# EAGLE design Stromlaufplan_Wetterstation_Team1_EAGLE7 (EAGLE 7.7.0)
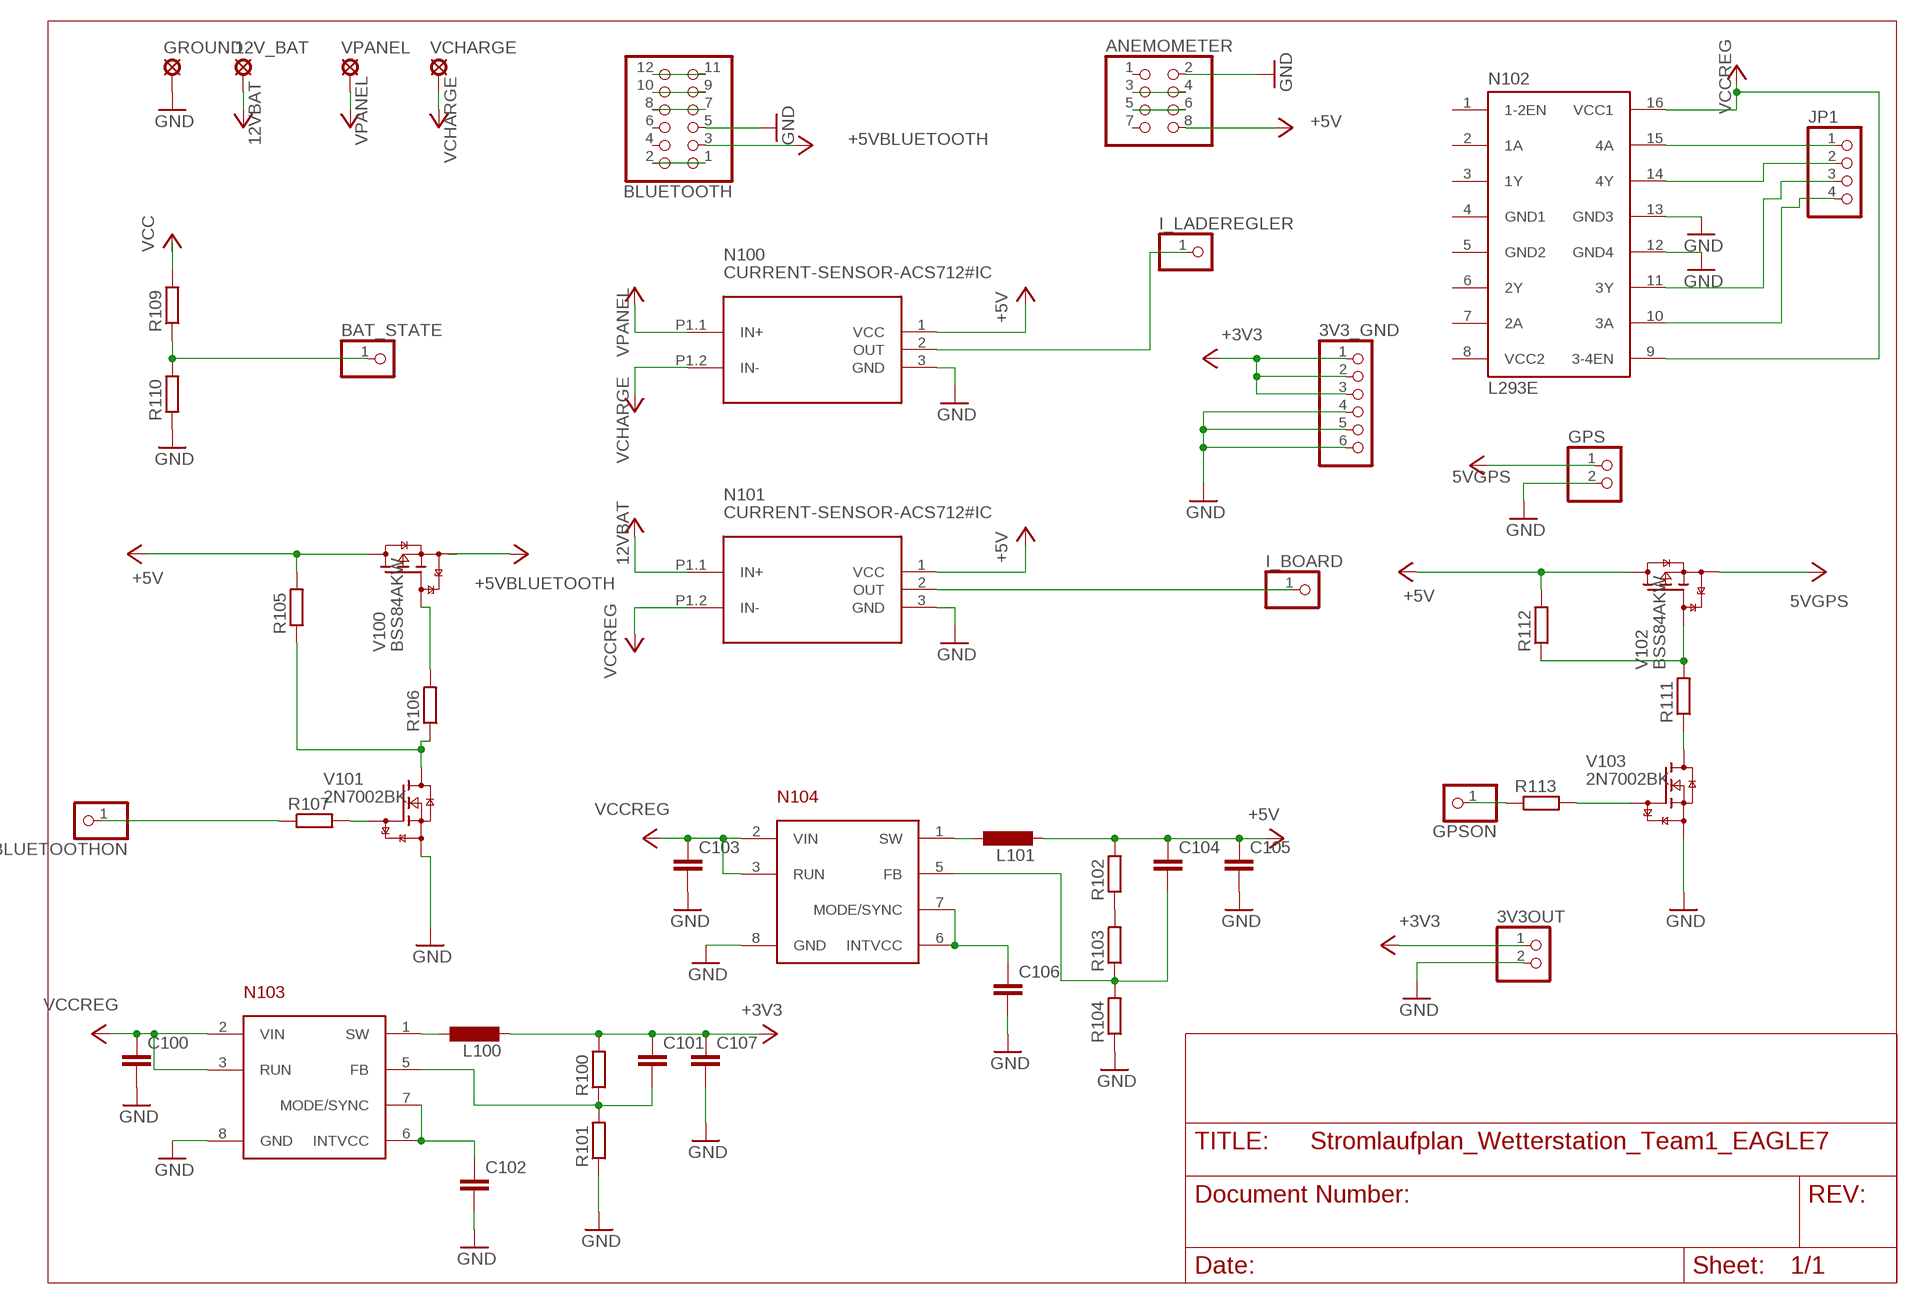
[diagram p0: schematic, sheet 1]

## Parts
3V3_GND  PINHD-1X6  [1X06]
3V3OUT  PINHD-1X2  [1X02]
12V_BAT  SE14  [SE14]
ANEMOMETER  PINHD-2X4  [2X04]
BAT_STATE  PINHD-1X1  [1X01]
BLUETOOTH  PINHD-2X6  [2X06]
BLUETOOTHON  PINHD-1X1  [1X01]
C100  C-EUC0603  [C0603]
C101  C-EUC0603  [C0603]
C102  C-EUC0603  [C0603]
C103  C-EUC0603  [C0603]
C104  C-EUC0603  [C0603]
C105  C-EUC0603  [C0603]
C106  C-EUC0603  [C0603]
C107  C-EUC0603  [C0603]
GPS  PINHD-1X2  [1X02]
GPSON  PINHD-1X1  [1X01]
GROUND  SE14  [SE14]
I_BOARD  PINHD-1X1  [1X01]
I_LADEREGLER  PINHD-1X1  [1X01]
JP1  PINHD-1X4  [1X04]
L100  L-EU0207/5V  [0207/5V]
L101  L-EU0207/5V  [0207/5V]
N100  CURRENT-SENSOR-ACS712#IC  [CURRENT-SENSOR-ACS712#IC]
N101  CURRENT-SENSOR-ACS712#IC  [CURRENT-SENSOR-ACS712#IC]
N102  L293E  [DIL16]
N103  LTC3621  [LTC3621FP]
N104  LTC3621  [LTC3621FP]
R100  R-EU_R0603  [R0603]
R101  R-EU_R0603  [R0603]
R102  R-EU_R0603  [R0603]
R103  R-EU_R0603  [R0603]
R104  R-EU_R0603  [R0603]
R105  100k  R-EU_R0603  [R0603]
R106  1k  R-EU_R0603  [R0603]
R107  1k  R-EU_R0603  [R0603]
R109  270k  R-EU_R0603  [R0603]
R110  100k  R-EU_R0603  [R0603]
R111  R-EU_R0603  [R0603]
R112  R-EU_R0603  [R0603]
R113  R-EU_R0603  [R0603]
V100  BSS84AKW  [SOT323]
V101  2N7002BK  [SOT23]
V102  BSS84AKW  [SOT323]
V103  2N7002BK  [SOT23]
VCHARGE  SE14  [SE14]
VPANEL  SE14  [SE14]

## Nets
5VGPS: GPS.1 V102.2(S) ; supply symbol labelled VCC
12VBAT: 12V_BAT.MP N101.P1.1(IN+) R109.2 ; supply symbol labelled VCC
+3V3: 3V3_GND.1 3V3_GND.2 3V3_GND.3 3V3OUT.1 C101.1 C107.1 L100.2 R100.2 ; supply symbol labelled VCC
+5V: ANEMOMETER.8 C104.1 C105.1 L101.2 N100.1(VCC) N101.1(VCC) R102.2 R105.2 R112.2 V100.3(D) V102.3(D) ; supply symbol labelled VCC
+5VBLUETOOTH: BLUETOOTH.3 V100.2(S) ; supply symbol labelled +5V
BLUETOOTH_ON: BLUETOOTHON.1 R107.1
GND: 3V3_GND.4 3V3_GND.5 3V3_GND.6 3V3OUT.2 ANEMOMETER.2 BLUETOOTH.5 C100.2 C102.2 C103.2 C105.2 C106.2 C107.2 GPS.2 GROUND.MP N100.3(GND) N101.3(GND) N102.12(GND4) N102.13(GND3) N103.8(GND) N104.8(GND) R101.1 R104.1 R110.1 V101.2(S) V103.2(S)
N$1: R106.2 V100.1(G)
N$2: C102.1 N103.6(INTVCC) N103.7(MODE/SYNC)
N$3: R107.2 V101.1(G)
N$4: R105.1 R106.1 V101.3(D)
N$5: L100.1 N103.1(SW)
N$6: JP1.1 N102.15(4A)
N$7: JP1.2 N102.14(4Y)
N$8: JP1.3 N102.11(3Y)
N$9: JP1.4 N102.10(3A)
N$10: L101.1 N104.1(SW)
N$11: C101.2 N103.5(FB) R100.1 R101.2
N$12: C106.1 N104.6(INTVCC) N104.7(MODE/SYNC)
N$13: R102.1 R103.2
N$14: C104.2 N104.5(FB) R103.1 R104.2
N$15: I_LADEREGLER.1 N100.2(OUT)
N$16: I_BOARD.1 N101.2(OUT)
N$17: BAT_STATE.1 R109.1 R110.2
N$18: R113.2 V103.1(G)
N$19: R111.1 V103.3(D)
N$20: R111.2 R112.1 V102.1(G)
N$21: GPSON.1 R113.1
N$22: BLUETOOTH.1 BLUETOOTH.2
N$23: BLUETOOTH.11 BLUETOOTH.12
N$24: BLUETOOTH.9 BLUETOOTH.10
N$25: BLUETOOTH.7 BLUETOOTH.8
N$26: ANEMOMETER.3 ANEMOMETER.4
N$27: ANEMOMETER.5 ANEMOMETER.6
VCCREG: C100.1 C103.1 N101.P1.2(IN-) N102.9(3-4EN) N102.16(VCC1) N103.2(VIN) N103.3(RUN) N104.2(VIN) N104.3(RUN) ; supply symbol labelled VCC
VCHARGE: N100.P1.2(IN-) VCHARGE.MP ; supply symbol labelled VCC
VPANEL: N100.P1.1(IN+) VPANEL.MP ; supply symbol labelled VCC
Unconnected: ANEMOMETER.1 ANEMOMETER.7 BLUETOOTH.4 BLUETOOTH.6 N102.1(1-2EN) N102.2(1A) N102.3(1Y) N102.6(2Y) N102.7(2A)

## Power pins joined to a net without a drawn wire
GND1: N102.4(GND1)
GND2: N102.5(GND2)
VCC2: N102.8(VCC2)

## Library data of the parts
3V3_GND = pinhead:PINHD-1X6: PIN HEADER
3V3OUT GPS = pinhead:PINHD-1X2: PIN HEADER
12V_BAT GROUND VCHARGE VPANEL = solpad:SE14: SOLDER PAD E1553, drill 1,4mm, distributor Buerklin, 07F820
ANEMOMETER = pinhead:PINHD-2X4: PIN HEADER
BAT_STATE BLUETOOTHON GPSON I_BOARD I_LADEREGLER = pinhead:PINHD-1X1: PIN HEADER
BLUETOOTH = pinhead:PINHD-2X6: PIN HEADER
C100-C107 = rcl:C-EU: CAPACITOR, European symbol; SPICEPREFIX: C
JP1 = pinhead:PINHD-1X4: PIN HEADER
L100 L101 = rcl:L-EU: INDUCTOR, European symbol; SPICEPREFIX: L
N100 N101 = diy-modules:CURRENT-SENSOR-ACS712#IC: Isolated Bipolar Current Sensors based on ACS712 chip Symbol with input pins More details available here: http://embedded-lab.com/blog/a-brief-overview-of-allegro-acs712-current-sensor-part-1/ Click here to find device on ebay.com <http://www.ebay.com/sch/acs712+module> Note: There are many available versions with different pinout. Please check before use
N102 = texas:L293E: TI DEVICE; MF: Arrow Electronics; MPN: L293E; OC_FARNELL: 1467711; OC_NEWARK: 89K0732
N103 N104 = SOP65P490X110-8N:LTC3621
R100-R107 R109-R113 = rcl:R-EU_: RESISTOR, European symbol; SPICEPREFIX: R
V100 V102 = nxp_60:BSS84A: 50 V, 150 mA P-channel Trench MOSFET P-channel enhancement mode Field-Effect Transistor (FET) in a small Surface-Mounted Device (SMD) plastic package using Trench MOSFET technology. AAL Eindhoven MK
V101 V103 = nxp_60:2N7002B: 60 V, single N-channel Trench MOSFET N-channel enhancement mode Field-Effect Transistor (FET) in a leadless ultra small DFN1006B-3 (SOT883B) Surface-Mounted Device (SMD) plastic package using Trench MOSFET technology. AAL Eindhoven MK

## Board
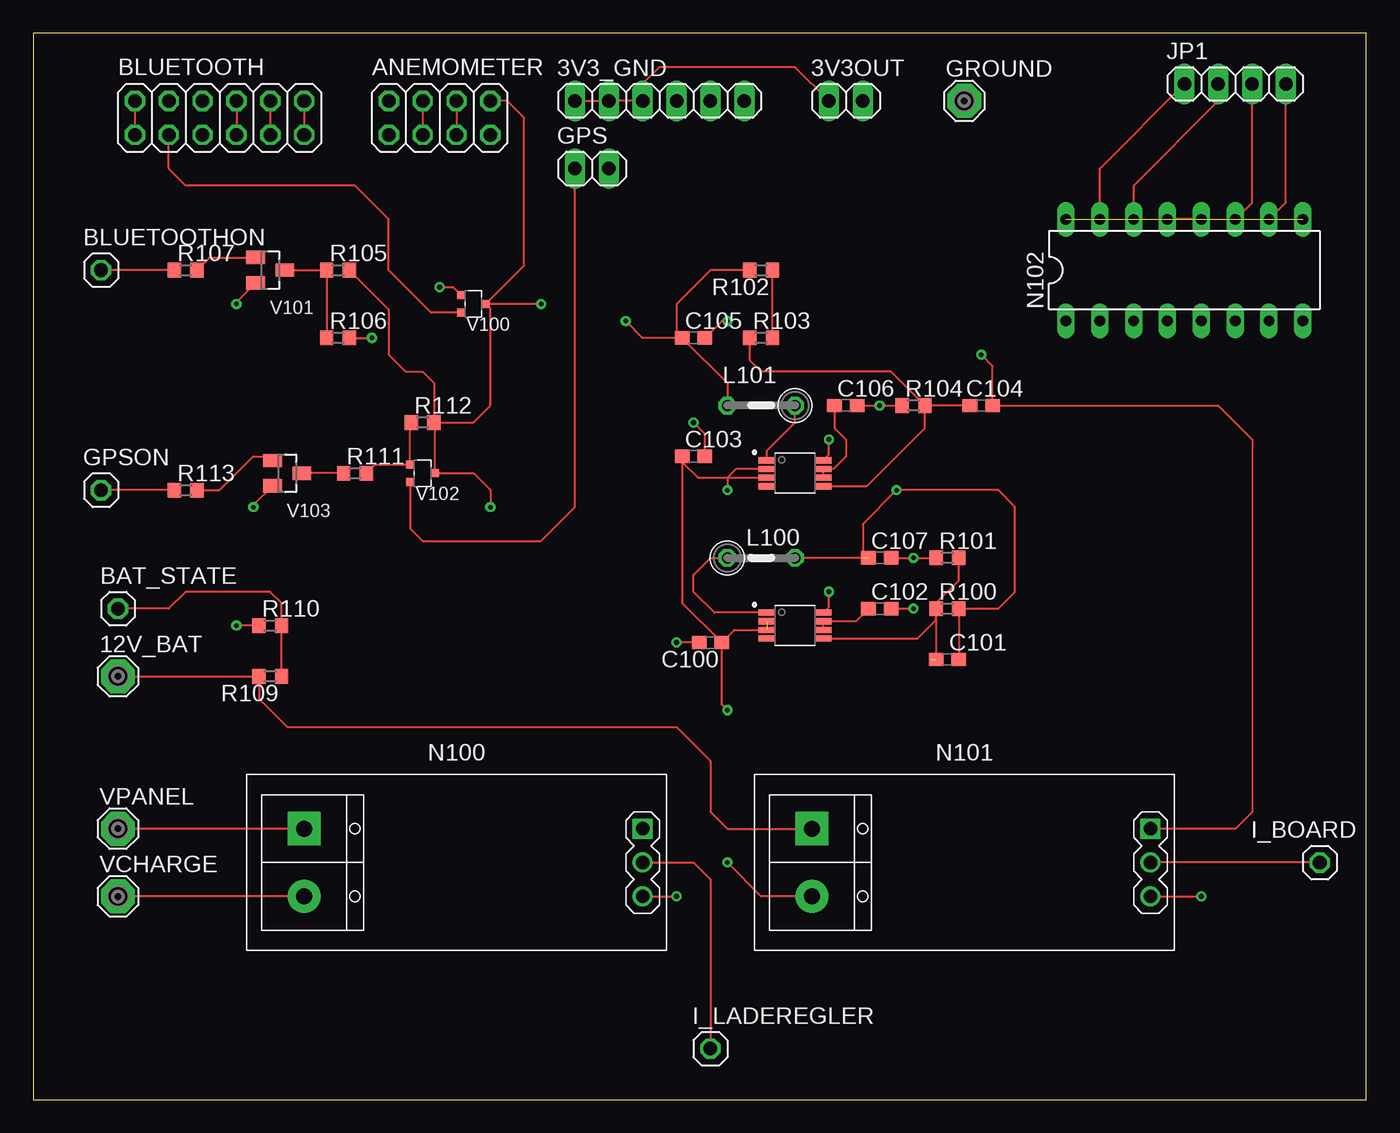
[diagram p1: board, top side]
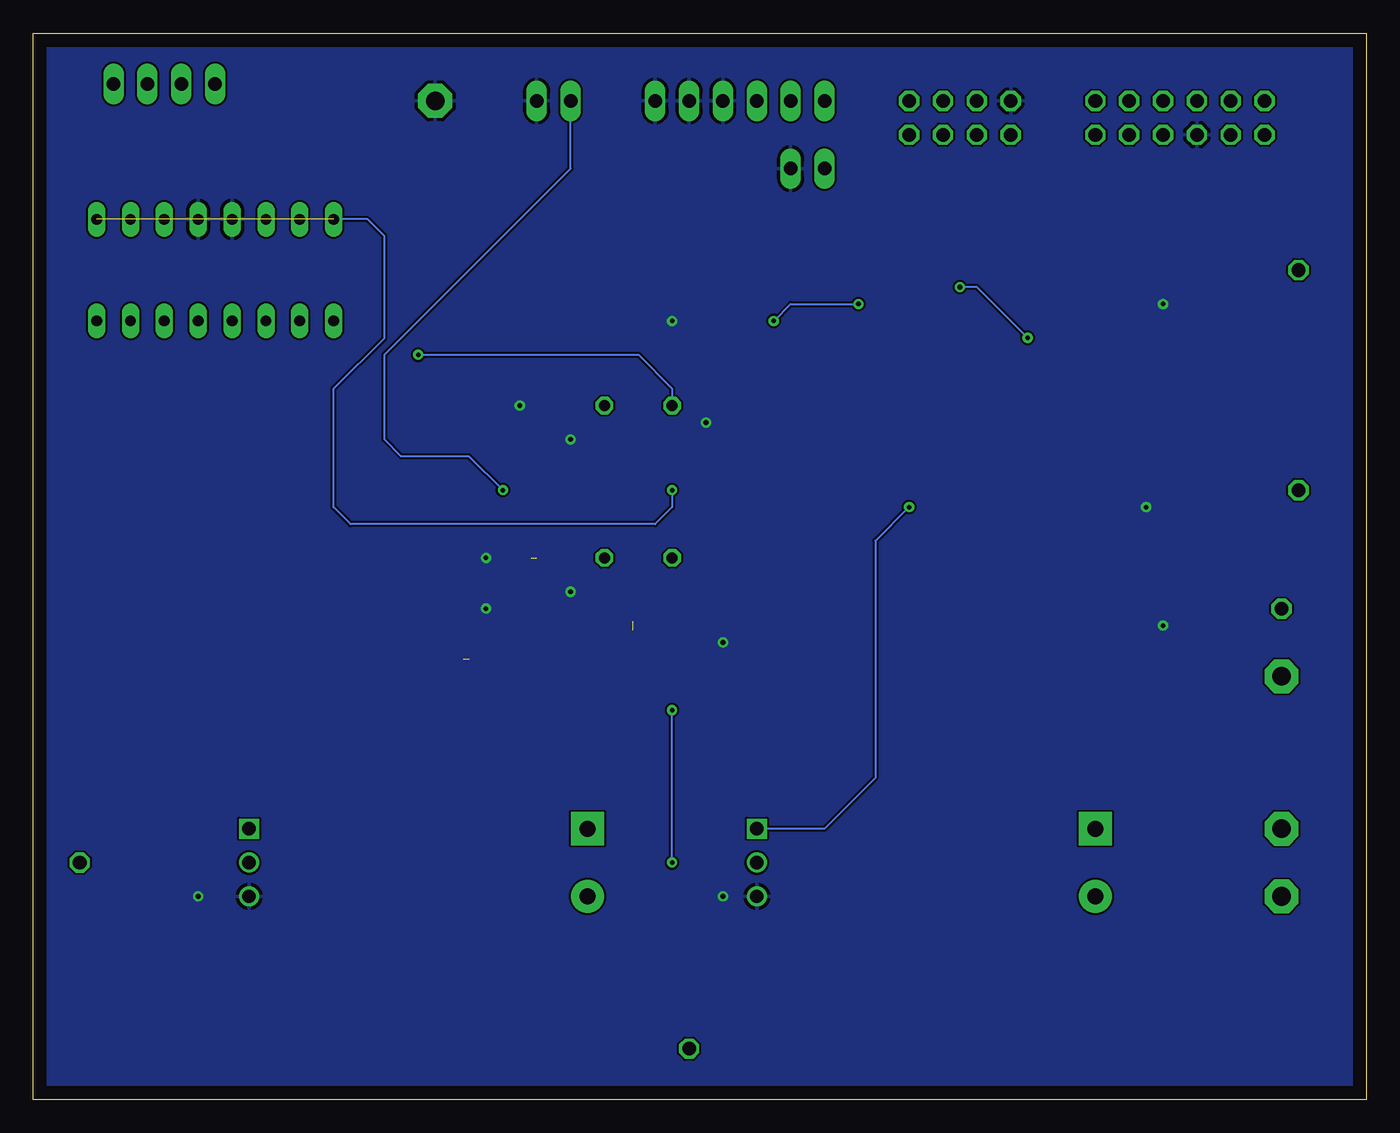
[diagram p2: board, bottom side, seen from below]

Size 100 x 80 mm. Coordinates in mm from the lower left corner, seen from the top.
Outline: 0,0 100,0 100,80 0,80 0,0
Copper layers (1*16): Top 0.035mm / dielectric 1.5mm / Bottom 0.035mm
Design rules "default": minimum track width 6mil, minimum drill 0.35mm, track to track 6mil, track to pad 6mil, pad to pad 6mil, via to via 6mil, smd to smd 6mil, copper to edge 40mil, drill to drill 6mil, minimum pad ring 10mil, minimum via ring 8mil, stop-mask expansion 4mil, vias tented up to drill 0mil, thermal gap 10mil

### Footprints (pad centres in the part's own frame; a part is rotated, then mirrored left to right if it is on the bottom)
1X06 = drill 1.016 long: 1 -6.35,0; 2 -3.81,0; 3 -1.27,0; 4 1.27,0; 5 3.81,0; 6 6.35,0
1X02 = drill 1.016 long: 1 -1.27,0; 2 1.27,0
SE14 = drill 1.397 pad 2.54 octagon: MP 0,0
2X04 = drill 1.016 octagon: 1 -3.81,-1.27; 2 -3.81,1.27; 3 -1.27,-1.27; 4 -1.27,1.27; 5 1.27,-1.27; 6 1.27,1.27; 7 3.81,-1.27; 8 3.81,1.27
1X01 = drill 1.016 octagon: 1 0,0
2X06 = drill 1.016 octagon: 1 -6.35,-1.27; 2 -6.35,1.27; 3 -3.81,-1.27; 4 -3.81,1.27; 5 -1.27,-1.27; 6 -1.27,1.27; 7 1.27,-1.27; 8 1.27,1.27; 9 3.81,-1.27; 10 3.81,1.27; 11 6.35,-1.27; 12 6.35,1.27
C0603 = smd 1.1 x 1: 1 -0.85,0; 2 0.85,0
1X04 = drill 1.016 long: 1 -3.81,0; 2 -1.27,0; 3 1.27,0; 4 3.81,0
0207/5V = drill 0.813 octagon: 1 -2.54,0; 2 2.54,0
CURRENT-SENSOR-ACS712#IC = drill 1 square: 1 13.97,2.54 | drill 1: 2 13.97,0; 3 13.97,-2.54 | drill 1.2 pad 2.5 square: P1.1 -11.43,2.54 | drill 1.2 pad 2.5: P1.2 -11.43,-2.54
DIL16 = drill 0.813 long: 1 -8.89,-3.81; 2 -6.35,-3.81; 3 -3.81,-3.81; 4 -1.27,-3.81; 5 1.27,-3.81; 6 3.81,-3.81; 7 6.35,-3.81; 8 8.89,-3.81; 9 8.89,3.81; 10 6.35,3.81; 11 3.81,3.81; 12 1.27,3.81; 13 -1.27,3.81; 14 -3.81,3.81; 15 -6.35,3.81; 16 -8.89,3.81
LTC3621FP = smd 1.25 x 0.46: 1 -2.11,0.975; 2 -2.11,0.325; 3 -2.11,-0.325; 4 -2.11,-0.975; 5 2.11,-0.975; 6 2.11,-0.325; 7 2.11,0.325; 8 2.11,0.975
R0603 = smd 1 x 1.1: 1 -0.85,0; 2 0.85,0
SOT323 = smd 0.6 x 0.6: 1 -0.65,-0.925; 2 0.65,-0.925; 3 0,0.925
SOT23 = smd 1 x 1.4: 1 -0.95,-1.1; 2 0.95,-1.1; 3 0,1.1

### Placement (x,y rotation side)
3V3_GND  46.99,74.93 0 top
3V3OUT  60.96,74.93 0 top
12V_BAT  6.35,31.75 0 top
ANEMOMETER  30.48,73.66 0 top
BAT_STATE  6.35,36.83 0 top
BLUETOOTH  13.97,73.66 0 top
BLUETOOTHON  5.08,62.23 0 top
C100  50.8,34.29 180 top
C101  68.58,33.02 180 top
C102  63.5,36.83 0 top
C103  49.53,48.26 0 top
C104  71.12,52.07 180 top
C105  49.53,57.15 0 top
C106  60.96,52.07 0 top
C107  63.5,40.64 0 top
GPS  41.91,69.85 0 top
GPSON  5.08,45.72 0 top
GROUND  69.85,74.93 0 top
I_BOARD  96.52,17.78 0 top
I_LADEREGLER  50.8,3.81 0 top
JP1  90.17,76.2 0 top
L100  54.61,40.64 0 top
L101  54.61,52.07 180 top
N100  31.75,17.78 0 top
N101  69.85,17.78 0 top
N102  86.36,62.23 0 top
N103  57.15,35.56 0 top
N104  57.15,46.99 0 top
R100  68.58,36.83 0 top
R101  68.58,40.64 0 top
R102  54.61,62.23 180 top
R103  54.61,57.15 0 top
R104  66.04,52.07 0 top
R105  22.86,62.23 0 top
R106  22.86,57.15 0 top
R107  11.43,62.23 0 top
R109  17.78,31.75 180 top
R110  17.78,35.56 0 top
R111  24.13,46.99 0 top
R112  29.21,50.8 0 top
R113  11.43,45.72 0 top
V100  33.02,59.69 270 top
V101  17.78,62.23 270 top
V102  29.21,46.99 270 top
V103  19.05,46.99 270 top
VCHARGE  6.35,15.24 0 top
VPANEL  6.35,20.32 0 top

### Tracks (layer width: path | path; a pad name or v marks a point on that pad's centre or on a via)
5VGPS
  Top 0.152: V102.2 28.29,42.84 29.21,41.91 38.1,41.91 40.64,44.45 GPS.1
12VBAT
  Top 0.152: 12V_BAT.MP R109.2 16.93,30.06 19.05,27.94 48.26,27.94 50.8,25.4 50.8,21.59 52.07,20.32 N101.P1.1
+3V3  (via drill 0.35)  (1 unrouted)
  Top 0.152: C101.1 R100.2 72.39,36.83 73.66,38.1 73.66,44.45 72.39,45.72 v64.77,45.72 62.23,43.18 62.23,40.64 | C107.1 L100.2 | 3V3OUT.1 57.15,77.47 46.99,77.47 45.72,76.2 3V3_GND.3 3V3_GND.2 3V3_GND.1
  Bottom 0.152: v64.77,45.72 67.31,48.26 72.39,48.26 73.66,49.53 73.66,55.88 59.69,69.85 3V3OUT.1
+5V  (via drill 0.35)
  Top 0.152: R112.2 30.14,50.73 V102.3 33.02,46.99 34.29,45.72 v34.29,44.45 | R105.2 26.67,59.27 26.67,55.88 27.94,54.61 29.21,54.61 30.06,53.76 R112.2 | R112.2 33.02,50.8 34.29,52.07 34.29,59.34 V100.3 34.12,59.86 | 34.12,59.86 36.83,62.58 36.83,73.66 35.56,74.93 ANEMOMETER.8 | L101.2 52.07,53.76 C105.1 48.26,57.15 | 48.26,57.15 45.72,57.15 v44.45,58.42 | v38.1,59.69 34.29,59.69 34.12,59.86 | v71.12,55.88 71.97,55.03 C104.1 88.9,52.07 91.44,49.53 91.44,21.59 90.17,20.32 N101.1 | R102.2 50.8,62.23 48.26,59.69 48.26,57.15
  Bottom 0.152: v34.29,44.45 36.83,41.91 36.83,24.13 40.64,20.32 N100.1 | v44.45,58.42 43.18,59.69 v38.1,59.69 | v71.12,55.88 54.61,55.88 52.07,53.34 L101.2
+5VBLUETOOTH
  Top 0.152: V100.2 29.86,59.04 26.67,62.23 26.67,66.04 24.13,68.58 11.43,68.58 10.16,69.85 BLUETOOTH.3
BLUETOOTH_ON
  Top 0.152: R107.1 BLUETOOTHON.1
GND  (via drill 0.35)
  Top 0.152: N102.12 N102.13 | V101.2 15.24,59.84 v15.24,59.69 | V103.2 16.51,44.6 v16.51,44.45 | R110.1 v15.24,35.56 | C100.2 v48.26,34.29 | C102.2 v66.04,36.83 | N103.8 59.69,36.97 v59.69,38.1 | N101.3 v87.63,15.24 | N100.3 v48.26,15.24 | C107.2 v66.04,40.64 R101.1 | N104.8 59.69,48.4 v59.69,49.53 | C106.2 v63.5,52.07 R104.1 | C103.2 50.38,49.95 v49.53,50.8 | C105.2 51.65,58.42 v52.07,58.42
  pour Bottom: -8.89,83.82 -8.89,-7.62 110.49,-7.62 110.49,83.82
N$1  (via drill 0.35)
  Top 0.152: R106.2 v25.4,57.15 | v30.48,60.96 31.48,60.96 V100.1
  Bottom 0.152: v25.4,57.15 29.21,60.96 v30.48,60.96
N$2
  Top 0.152: C102.1 61.7,35.88 N103.7 N103.6
N$3
  Top 0.152: R107.2 13.23,63.18 V101.1
N$4
  Top 0.152: V101.3 R105.1 R106.1
N$5
  Top 0.152: N103.1 51.09,36.53 49.53,38.1 49.53,39.37 50.8,40.64 L100.1
N$6
  Top 0.152: N102.15 80.01,69.85 JP1.1
N$7
  Top 0.152: N102.14 82.55,68.58 88.9,74.93 JP1.2
N$8
  Top 0.152: N102.11 91.44,67.31 JP1.3
N$9
  Top 0.152: N102.10 93.98,67.31 JP1.4
N$10
  Top 0.152: N104.1 55.04,48.69 57.15,50.8 L101.1
N$11  (1 unrouted)
  Top 0.152: N103.5 66.33,34.59 67.73,35.98 R100.1 | R100.1 67.73,37.25 69.43,38.95 R101.2 | R100.1 67.73,33.44 67.31,33.02
N$12
  Top 0.152: C106.1 60.11,50.38 60.96,49.53 60.96,48.26 60.02,47.31 N104.7 N104.6
N$13
  Top 0.152: R103.2 R102.1
N$14
  Top 0.152: N104.5 62.52,46.02 66.89,50.38 R104.2 | C104.2 R104.2 | R104.2 64.35,54.61 54.61,54.61 53.76,55.46 R103.1
N$15
  Top 0.152: N100.2 49.53,17.78 50.8,16.51 I_LADEREGLER.1
N$16
  Top 0.152: I_BOARD.1 N101.2
N$17
  Top 0.152: R109.1 R110.2 18.63,37.25 17.78,38.1 11.43,38.1 10.16,36.83 BAT_STATE.1
N$18
  Top 0.152: R113.2 13.97,45.72 16.51,48.26 17.63,48.26 V103.1
N$19
  Top 0.152: R111.1 V103.3
N$20
  Top 0.152: R111.2 25.63,47.64 V102.1 28.29,50.73 R112.1
N$21
  Top 0.152: R113.1 GPSON.1
N$22
  Top 0.152: BLUETOOTH.2 BLUETOOTH.1
N$23
  Top 0.152: BLUETOOTH.12 BLUETOOTH.11
N$24
  Top 0.152: BLUETOOTH.10 BLUETOOTH.9
N$25
  Top 0.152: BLUETOOTH.8 BLUETOOTH.7
N$26
  Top 0.152: ANEMOMETER.4 ANEMOMETER.3
N$27
  Top 0.152: ANEMOMETER.6 ANEMOMETER.5
VCCREG  (via drill 0.35)  (2 unrouted)
  Top 0.152: N101.P1.2 54.61,15.24 v52.07,17.78 | v52.07,29.21 51.65,29.63 C100.1 | 52.07,46.66 49.85,46.66 48.68,47.84 C103.1 48.68,37.26 C100.1 | 52.07,46.66 N104.3 | N104.2 52.72,47.31 52.07,46.66 | 52.07,46.66 v52.07,45.72 | C100.1 52.59,35.23 N103.3
  Bottom 0.152: v52.07,17.78 v52.07,29.21 | v52.07,45.72 52.07,44.45 53.34,43.18 76.2,43.18 77.47,44.45 77.47,53.34 73.66,57.15 73.66,64.77 74.93,66.04 N102.16
VCHARGE
  Top 0.152: N100.P1.2 VCHARGE.MP
VPANEL
  Top 0.152: N100.P1.1 VPANEL.MP